# Altium schematic sheet STM32F030C8T6.SchDoc
size 381 x 241 mm
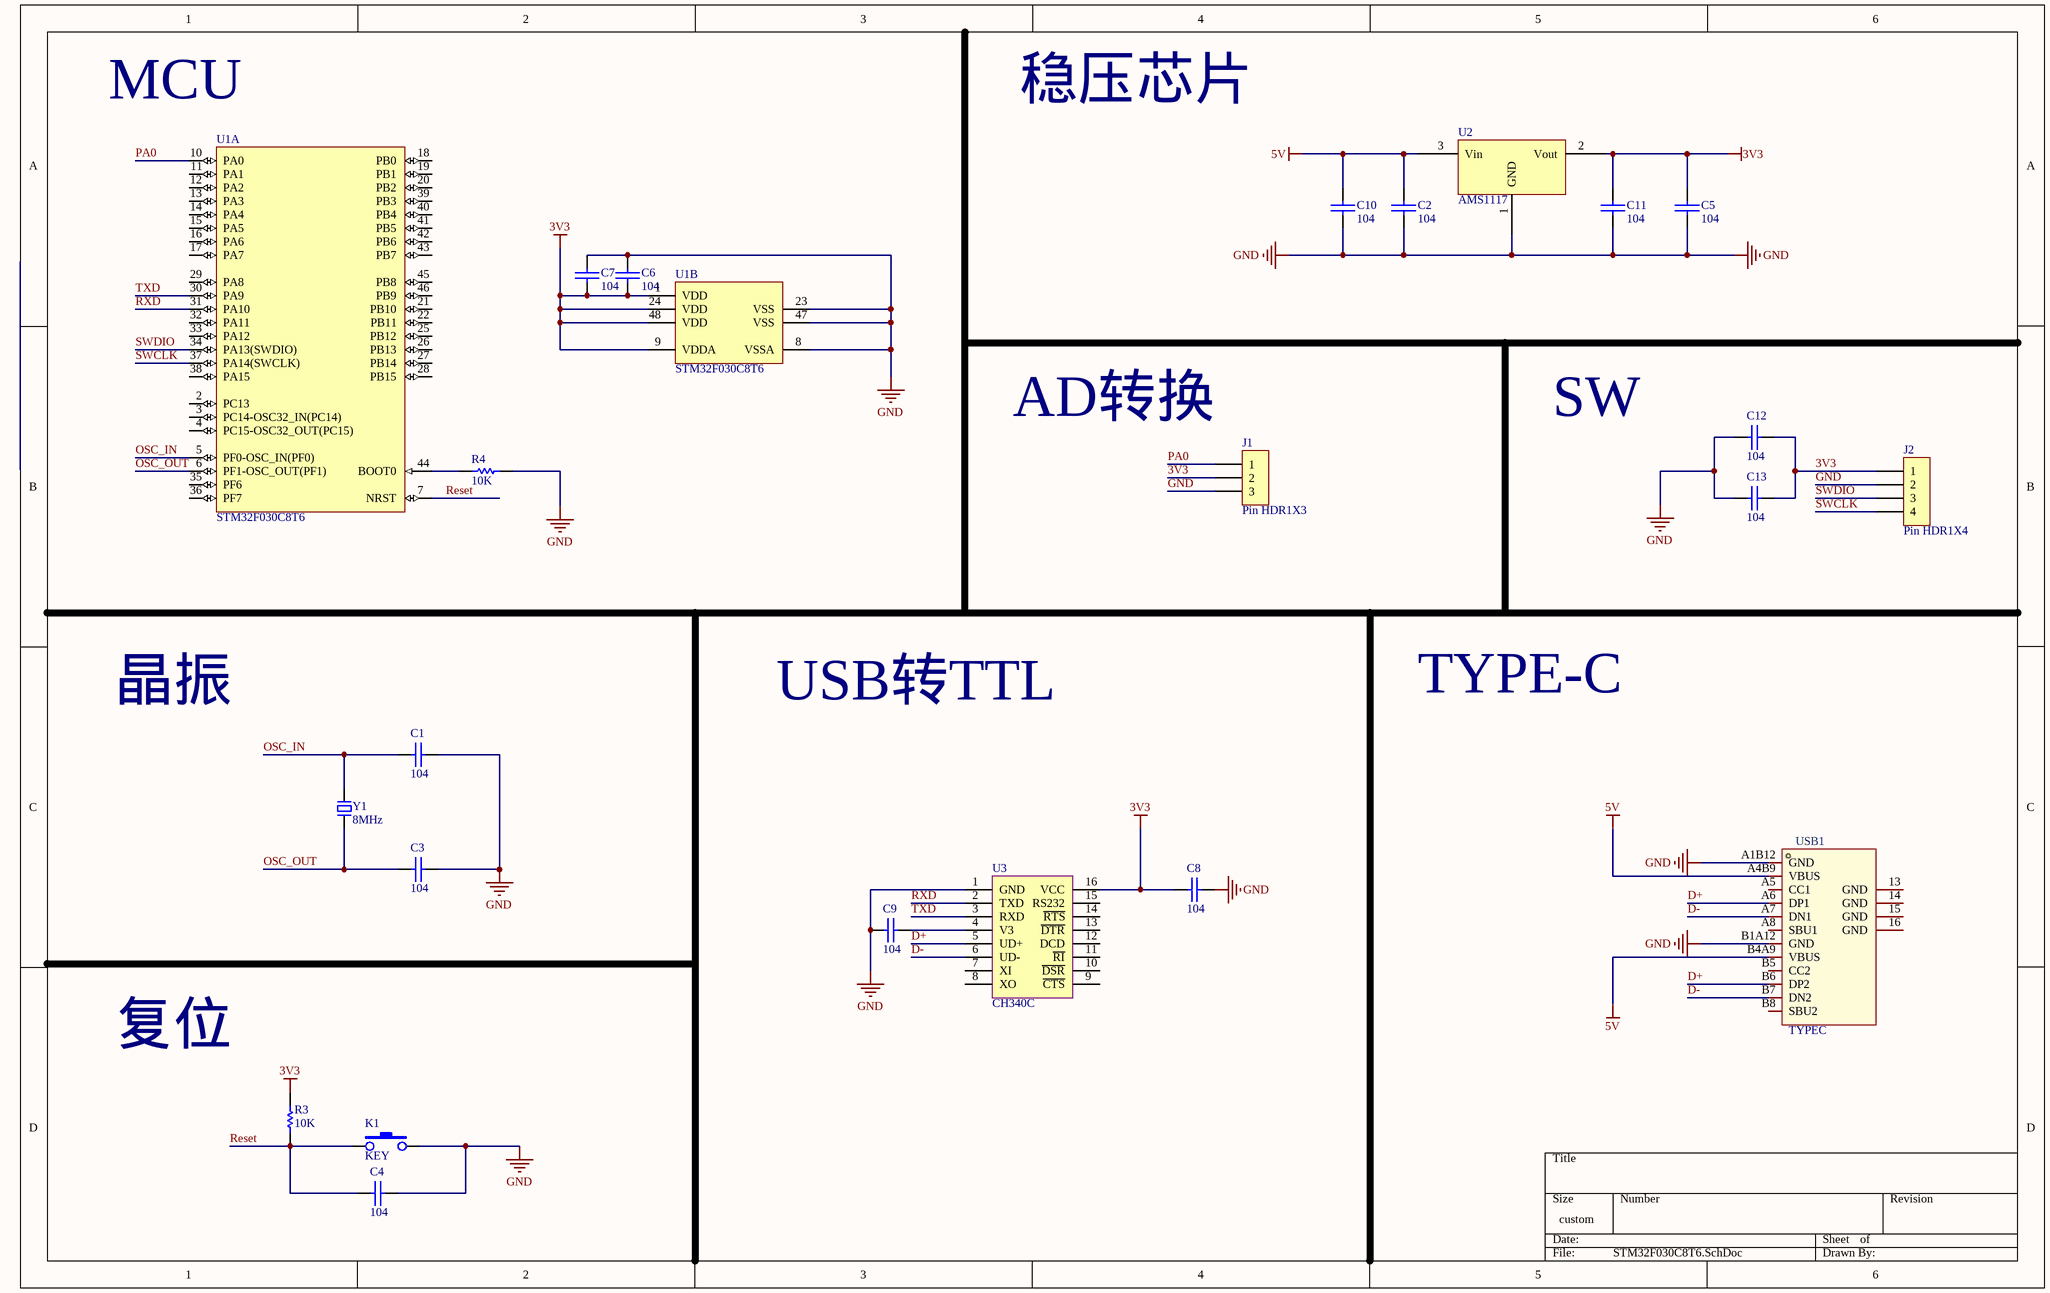
[diagram p0: STM32F030C8T6.SchDoc]

## Parts
C1  104  [0805C]
C2  104  [0805C]
C3  104  [0805C]
C4  104  [0805C]
C5  104  [0805C]
C6  104  [0805C]
C7  104  [0805C]
C8  104  [0805C]
C9  104  [0805C]
C10  104  [0805C]
C11  104  [0805C]
C12  104  [0805C]
C13  104  [0805C]
J1  Pin HDR1X3  [Pin HDR1X3/2.54mm-S]
J2  Pin HDR1X4  [Pin HDR1X4/2.54mm-S]
K1  KEY  [SMD-3X6X2.5]
R3  10K  [0805R]
R4  10K  [0805R]
U1  STM32F030C8T6  [STM-LQFP48_N]  (parts A,B of 2)
U2  AMS1117  [SOT223]
U3  CH340C  [SOP-16_L10.0-W3.9-P1.27-LS6.0-BL]
USB1  TYPEC  [USB-C-SMD_TYPEC-304-BCP16]
Y1  8MHz  [OSC 5032-2P]

## Nets
3V3: C5.1 C6.2 C7.2 C8.1 C11.1 C12.2 C13.2 J1.2 J2.1 R3.2 U1.1(VDD) U1.9(VDDA) U1.24(VDD) U1.48(VDD) U2.2(Vout) U3.16(VCC)
5V: C2.1 C10.1 U2.3(Vin) USB1.A4B9(VBUS) USB1.B4A9(VBUS)
GND: C1.2 C2.2 C3.2 C4.2 C5.2 C6.1 C7.1 C8.2 C9.1 C10.2 C11.2 C12.1 C13.1 J1.3 J2.2 K1.3 R4.2 U1.8(VSSA) U1.23(VSS) U1.47(VSS) U2.1(GND) U3.1(GND) USB1.A1B12(GND) USB1.B1A12(GND)
D+: U3.5(UD+) USB1.A6(DP1) USB1.B6(DP2)
D-: U3.6(UD-) USB1.A7(DN1) USB1.B7(DN2)
OSC_IN: C1.1 U1.5(PF0-OSC_IN(PF0)) Y1.2
OSC_OUT: C3.1 U1.6(PF1-OSC_OUT(PF1)) Y1.1
PA0: J1.1 U1.10(PA0)
Reset: C4.1 K1.1 R3.1 U1.7(NRST)
RXD: U1.31(PA10) U3.2(TXD)
SWCLK: J2.4 U1.37(PA14(SWCLK))
SWDIO: J2.3 U1.34(PA13(SWDIO))
TXD: U1.30(PA9) U3.3(RXD)
NetC9_2: C9.2 U3.4(V3)
NetR4_1: R4.1 U1.44(BOOT0)

Not connected (* = marked no-connect by the designer): U1 2(PC13) 3(PC14-OSC32_IN(PC14)) 4(PC15-OSC32_OUT(PC15)) 11(PA1) 12(PA2) 13(PA3) 14(PA4) 15(PA5) 16(PA6) 17(PA7) 18(PB0) 19(PB1) 20(PB2) 21(PB10) 22(PB11) 25(PB12) 26(PB13) 27(PB14) 28(PB15) 29(PA8) 32(PA11) 33(PA12) 35(PF6) 36(PF7) 38(PA15) 39(PB3) 40(PB4) 41(PB5) 42(PB6) 43(PB7) 45(PB8) 46(PB9); U3 7(XI) 8(XO) 9(~{CTS}) 10(~{DSR}) 11(~{RI}) 12(DCD) 13(~{DTR}) 14(~{RTS}) 15(RS232); USB1 13(GND) 14(GND) 15(GND) 16(GND) A5(CC1) A8(SBU1) B5(CC2) B8(SBU2)

## Notes on the sheet
- (near U1) MCU
- 稳压芯片
- AD转换
- SW
- TYPE-C
- 晶振
- USB转TTL
- 复位

## Library data of the parts
C1-C13 = CAP: 无极性电容
R3 R4 = RES
U1 = STM32F030C8T6: ARM Cortex-M0 32-bit MCU, 64 KB Flash, 8 KB Internal RAM, 39 I/Os, 48-pin LQFP, -40 to 85 degC, Tray; FLASH Size (Prog) (kB): 64; I/Os (High Current): 39; Internal RAM Size (kB): 8; Operating Frequency(F) (Processor speed) (MHz): 48; Supply Voltage(Vcc) min (V): 2.4; DatasheetVersion: Rev. 1; PackageVersion: Rev. 6, 06/2013; PackageReference: LQFP48; PackageDescription: 48-Pin Low Profile Quad Flat Package, 7 x 7 mm Body, 0.5 mm Pitch; Supplier 1: Digi-Key; Supplier Part Number 1: 497-14043-ND; Supplier 2: Newark; Supplier Part Number 2: 06X3647; Supplier 3: Mouser; Supplier Part Number 3: 511-STM32F030C8T6; Core: ARM Cortex-M0; Packing: Tray; Mounting Technology: Surface Mount; PartNumber: STM32F030C8T6; ComponentLink1Description: Manufacturer URL; ComponentLink1URL: http://www.st.com/web/en/home.html; ComponentLink2Description: Datasheet; ComponentLink2URL: http://www.st.com/st-web-ui/static/active/en/resource/technical/document/datasheet/DM00088500.pdf; ComponentLink3Description: Package Specification; ComponentLink3URL: http://www.st.com/st-web-ui/static/active/en/resource/technical/document/datasheet/DM00058181.pdf
U2 = AMS1117: 三端稳压芯片
U3 = CH340G
USB1 = TYPEC-304-BCP16_C720629: Manufacturer: XUNPU(讯普); Add into BOM: yes; Connector Type: Type-C; Gender: 母座; Number of Contacts: 16; Number of Ports: 1; Current Rating - Power (Max): 3A; Welding Temperature (Max): 260℃; Name: TYPEC-304-BCP16; Symbol: TYPEC-304-BCP16; Device: TYPEC-304-BCP16_C720629; LCSC Part Name: Type-C 母座 卧贴 停产 停产; Supplier Part: C720629; Manufacturer Part: TYPEC-304-BCP16; Supplier Footprint: SMD; JLCPCB Part Class: Extended Part; Datasheet: https://atta.szlcsc.com/upload/public/pdf/source/20220210/1FE0FEFF7D6A20C111212527D3DED014.pdf; Supplier: LCSC; Convert to PCB: yes; Standard: USB 3.1; Mounting Style: 卧贴; Operating Temperature Range: -25℃~+85℃
Y1 = XTAL-2P: 2脚无源脚晶振